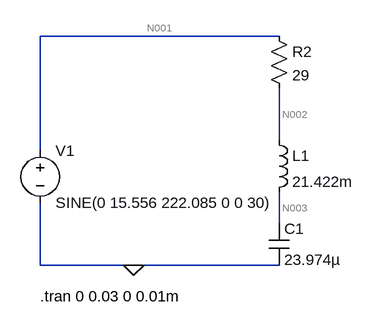
[diagram p0: schematic Draft1.asc]
Draft1.asc, the LTspice schematic file:
Version 4.1
SHEET 1 880 680
WIRE 272 -16 -96 -16
WIRE 272 144 272 64
WIRE -96 160 -96 -16
WIRE 272 272 272 224
WIRE -96 336 -96 240
WIRE 48 336 -96 336
WIRE 272 336 48 336
FLAG 48 336 0
SYMBOL voltage -96 144 R0
WINDOW 123 0 0 Left 0
WINDOW 39 0 0 Left 0
SYMATTR InstName V1
SYMATTR Value SINE(0 15.556 222.085 0 0 30)
SYMBOL ind 256 128 R0
SYMATTR InstName L1
SYMATTR Value 21.422m
SYMATTR SpiceLine Rser=15
SYMBOL res 256 -32 R0
SYMATTR InstName R2
SYMATTR Value 29
SYMBOL cap 256 272 R0
SYMATTR InstName C1
SYMATTR Value 23.974µ
TEXT -96 384 Left 2 !.tran 0 0.03 0 0.01m

The netlist it stands for:
* Draft1.asc
V1 N001 0 SINE(0 15.556 222.085 0 0 30)
L1 N002 N003 21.422m Rser=15
R2 N001 N002 29
C1 N003 0 23.974µ
.tran 0 0.03 0 0.01m
.backanno
.end

* Results of the author's LTspice run, read from the files saved beside the schematic
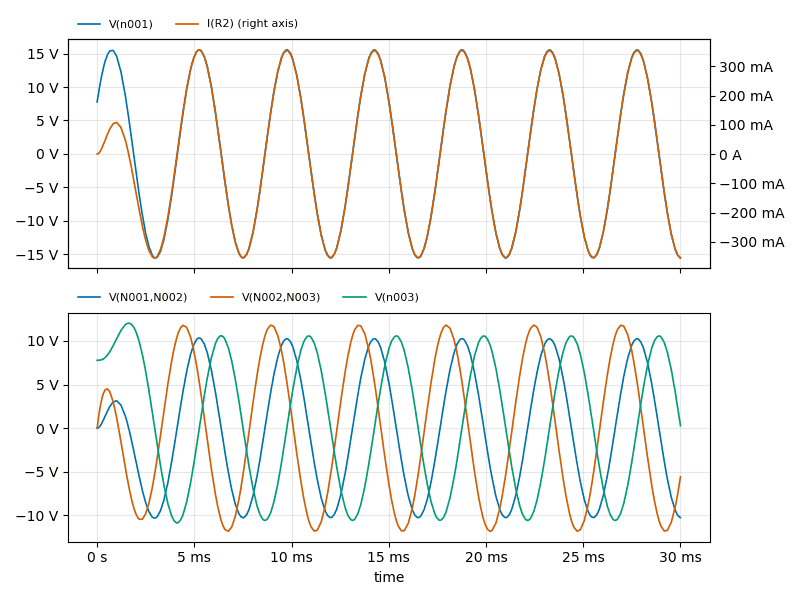
[diagram p1: Transient Analysis of Draft1.asc, plotted from the saved traces]
* Transient Analysis, 1 run:
*   V(n001): min -15.56 V, max 15.56 V, average 330 mV, rms 11.05 V, last -15.55 V
*   I(R2): min -355.4 mA, max 356.2 mA, average -6.021 mA, rms 243.5 mA, last -353.4 mA
*   V(N001,N002): min -10.31 V, max 10.33 V, average -174.6 mV, rms 7.062 V, last -10.25 V
*   V(N002,N003): min -11.82 V, max 11.82 V, average -342.2 mV, rms 8.203 V, last -5.575 V
*   V(n003): min -10.85 V, max 12.04 V, average 846.9 mV, rms 7.688 V, last 273.5 mV